# EAGLE design sensor-circuit-00_test (EAGLE 6.4)
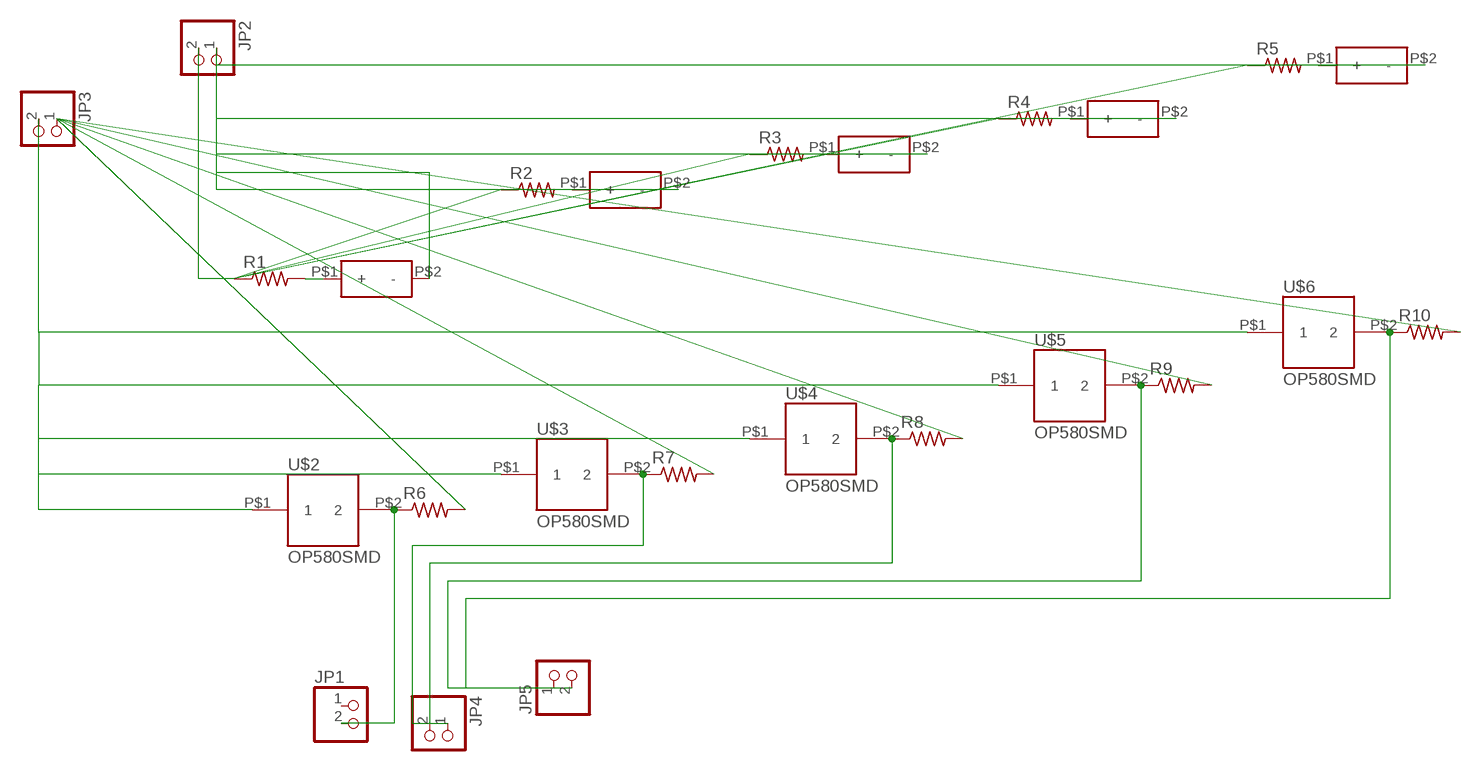
[diagram p0: schematic, sheet 1]

## Parts
JP1  PINHD-1X2  [1X02]
JP2  PINHD-1X2  [1X02]
JP3  PINHD-1X2  [1X02]
JP4  PINHD-1X2  [1X02]
JP5  PINHD-1X2  [1X02]
R1  RESISTOR1206  [1206]
R2  RESISTOR1206  [1206]
R3  RESISTOR1206  [1206]
R4  RESISTOR1206  [1206]
R5  RESISTOR1206  [1206]
R6  RESISTOR1206  [1206]
R7  RESISTOR1206  [1206]
R8  RESISTOR1206  [1206]
R9  RESISTOR1206  [1206]
R10  RESISTOR1206  [1206]
U$1  OP280SMD  [OP280]
U$2  OP580SMD  [OP580]
U$3  OP580SMD  [OP580]
U$4  OP580SMD  [OP580]
U$5  OP580SMD  [OP580]
U$6  OP580SMD  [OP580]
U$7  OP280SMD  [OP280]
U$8  OP280SMD  [OP280]
U$9  OP280SMD  [OP280]
U$10  OP280SMD  [OP280]

## Nets
N$1: R1.2 U$1.P$1(+)
N$2: R2.2 U$7.P$1(+)
N$3: R3.2 U$8.P$1(+)
N$4: R4.2 U$9.P$1(+)
N$5: R5.2 U$10.P$1(+)
N$6: JP1.2 R6.1 U$2.P$2
N$7: JP4.2 R7.1 U$3.P$2
N$8: JP4.1 R8.1 U$4.P$2
N$9: JP5.2 R9.1 U$5.P$2
N$10: JP5.1 R10.1 U$6.P$2
N$11: JP3.2 U$2.P$1 U$3.P$1 U$4.P$1 U$5.P$1 U$6.P$1
N$12: JP3.1 R6.2 R7.2 R8.2 R9.2 R10.2
N$13: JP2.1 U$1.P$2(-) U$7.P$2(-) U$8.P$2(-) U$9.P$2(-) U$10.P$2(-)
N$17: JP2.2 R1.1 R2.1 R3.1 R4.1 R5.1
Unconnected: JP1.1

## Library data of the parts
JP1-JP5 = pinhead:PINHD-1X2: PIN HEADER
R1-R10 = 01_ng:RESISTOR
U$1 U$7-U$10 = aalto-fablab:OP280
U$2-U$6 = aalto-fablab:OP580

## Board
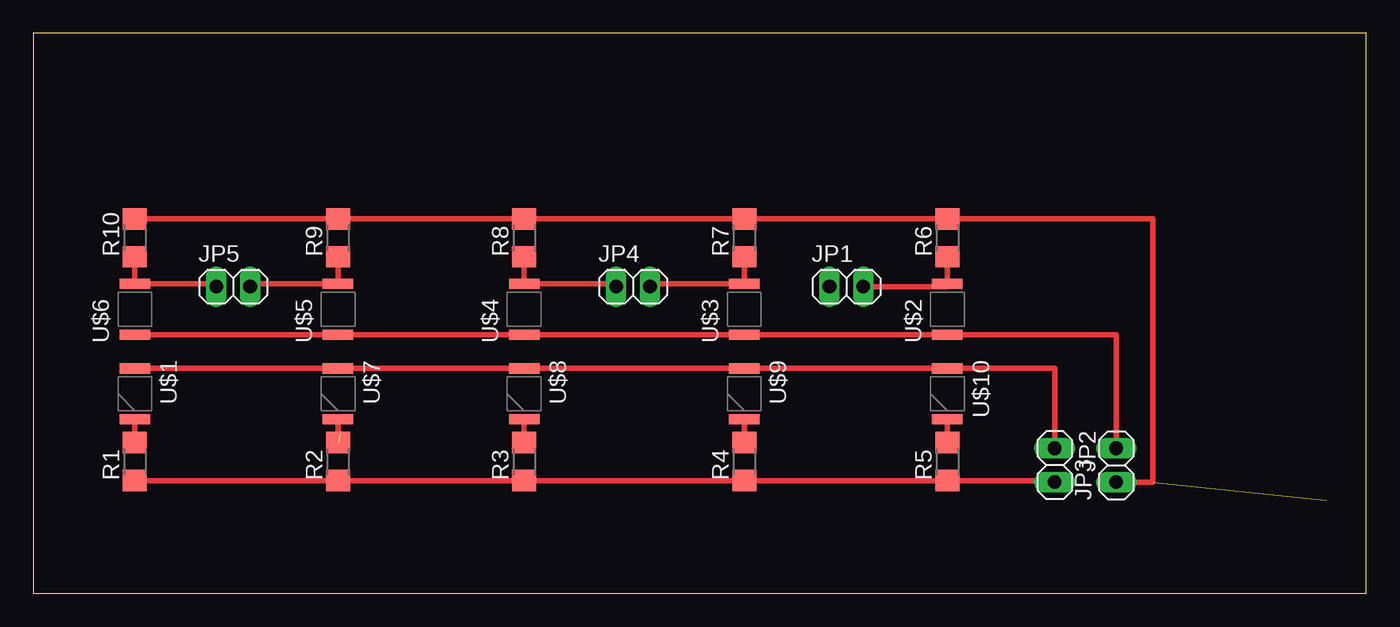
[diagram p1: board, top side]

Size 100 x 42 mm. Coordinates in mm from the lower left corner, seen from the top.
Outline: 0,0 100,0 100,42 0,42 0,0
Copper layers (1*16): Top 0.035mm / dielectric 1.5mm / Bottom 0.035mm
Design rules "default": minimum track width 10mil, minimum drill 24mil, track to track 8mil, track to pad 8mil, pad to pad 8mil, via to via 8mil, smd to smd 8mil, copper to edge 40mil, drill to drill 8mil, minimum pad ring 10mil, minimum via ring 8mil, stop-mask expansion 4mil, vias tented up to drill 0mil, thermal gap 10mil

### Footprints (pad centres in the part's own frame; a part is rotated, then mirrored left to right if it is on the bottom)
1X02 = drill 1.016 long: 1 -1.27,0; 2 1.27,0
1206 = smd 1.6 x 1.803: 1 -1.422,0; 2 1.422,0
OP280 = smd 0.762 x 2.286: P$1 1.905,0; P$2 -1.905,0
OP580 = smd 0.762 x 2.286: P$1 -1.905,0; P$2 1.905,0

### Placement (x,y rotation side)
JP1  61,23 0 top
JP2  76.63,9.61 270 top
JP3  81.25,9.61 90 top
JP4  45,23 0 top
JP5  15,23 0 top
R1  7.62,9.88 90 top
R2  22.86,9.88 90 top
R3  36.83,9.88 90 top
R4  53.34,9.88 90 top
R5  68.58,9.88 90 top
R6  68.58,26.66 90 top
R7  53.34,26.66 90 top
R8  36.83,26.66 90 top
R9  22.86,26.66 90 top
R10  7.62,26.66 90 top
U$1  7.62,14.96 270 top
U$2  68.58,21.31 90 top
U$3  53.34,21.31 90 top
U$4  36.83,21.31 90 top
U$5  22.86,21.31 90 top
U$6  7.62,21.31 90 top
U$7  22.86,14.96 270 top
U$8  36.83,14.96 270 top
U$9  53.34,14.96 270 top
U$10  68.58,14.96 270 top

### Tracks (layer width: path | path; a pad name or v marks a point on that pad's centre or on a via)
N$1
  Top 0.406: U$1.P$1 R1.2
N$2  (1 unrouted)
  Top 0.406: U$7.P$1 22.86,12 23,12
N$3
  Top 0.406: U$8.P$1 R3.2
N$4
  Top 0.406: U$9.P$1 R4.2
N$5
  Top 0.406: U$10.P$1 R5.2
N$6
  Top 0.406: R6.1 U$2.P$2 68.58,23 JP1.2
N$7
  Top 0.406: R7.1 U$3.P$2 46.27,23.21 JP4.2
N$8
  Top 0.406: R8.1 U$4.P$2 43.73,23.21 JP4.1
N$9
  Top 0.406: R9.1 U$5.P$2 16.27,23.21 JP5.2
N$10
  Top 0.406: R10.1 U$6.P$2 13.73,23.21 JP5.1
N$11
  Top 0.406: U$6.P$1 U$5.P$1 U$4.P$1 U$3.P$1 U$2.P$1 81.25,19.41 JP3.2
N$12  (1 unrouted)
  Top 0.406: R10.2 R9.2 R8.2 R7.2 R6.2 84,28.08 84,8.34 JP3.1
N$13
  Top 0.406: U$1.P$2 U$7.P$2 U$8.P$2 U$9.P$2 U$10.P$2 76.63,16.86 JP2.1
N$17
  Top 0.406: R1.1 R2.1 R3.1 R4.1 R5.1 76.63,8.46 JP2.2